# Altium schematic sheet Archim_TF_Top.SchDoc
size Tabloid
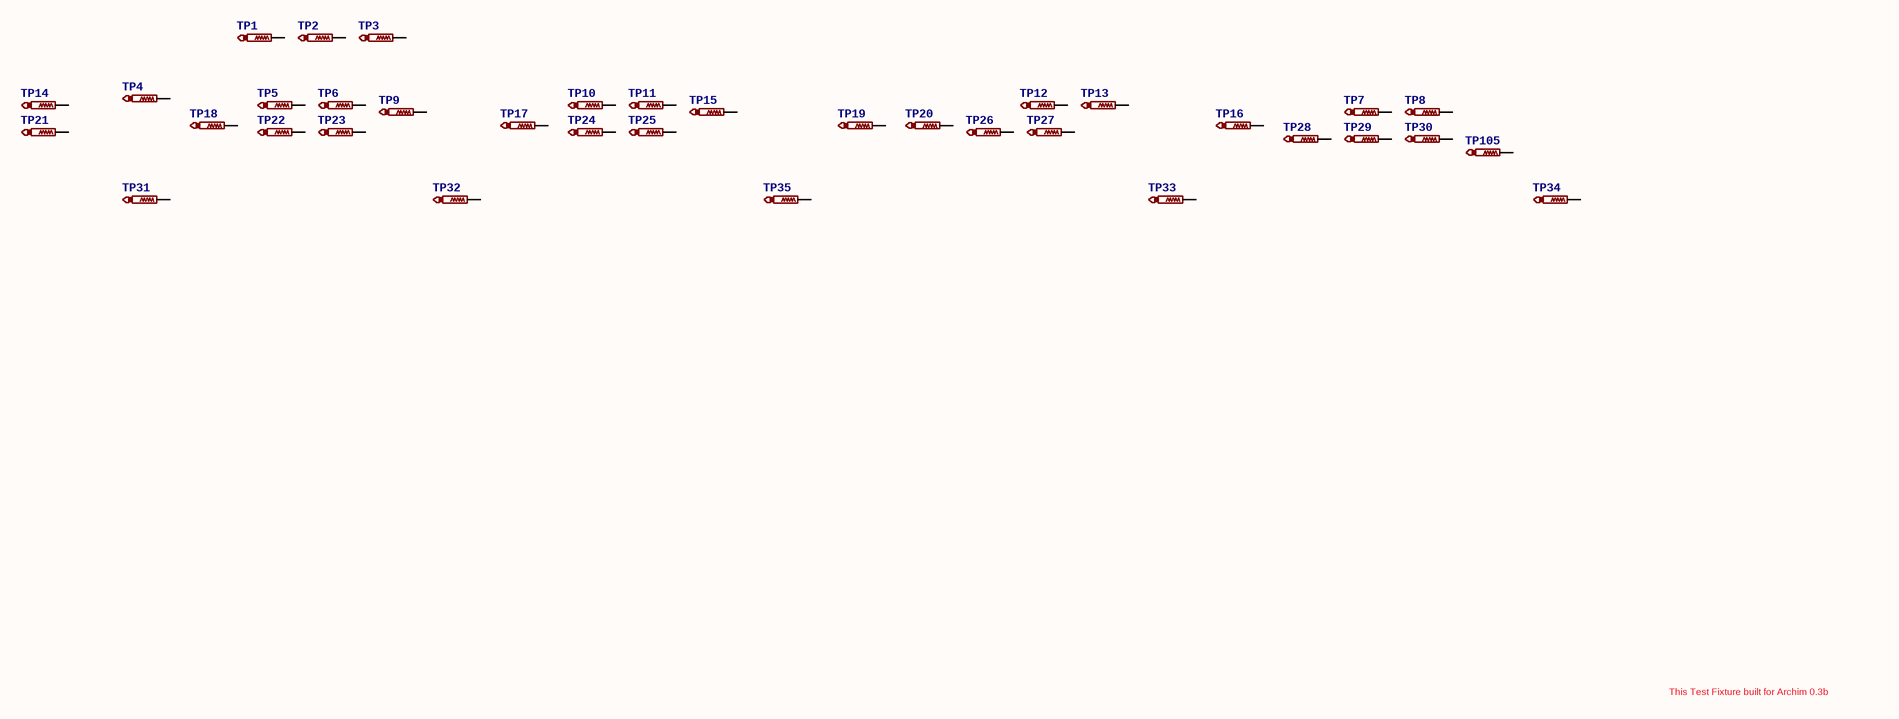
[diagram p0: Archim_TF_Top.SchDoc]

## Parts
TP1  P100-T  [POGO_38]  (value not drawn)
TP2  P100-T  [POGO_38]  (value not drawn)
TP3  P100-T  [POGO_38]  (value not drawn)
TP4  P100-T  [POGO_38]  (value not drawn)
TP5  P100-T  [POGO_38]  (value not drawn)
TP6  P100-T  [POGO_38]  (value not drawn)
TP7  P100-T  [POGO_38]  (value not drawn)
TP8  P100-T  [POGO_38]  (value not drawn)
TP9  P100-T  [POGO_38]  (value not drawn)
TP10  P100-T  [POGO_38]  (value not drawn)
TP11  P100-T  [POGO_38]  (value not drawn)
TP12  P100-T  [POGO_38]  (value not drawn)
TP13  P100-T  [POGO_38]  (value not drawn)
TP14  P100-T  [POGO_38]  (value not drawn)
TP15  P100-T  [POGO_38]  (value not drawn)
TP16  P100-T  [POGO_38]  (value not drawn)
TP17  P100-T  [POGO_38]  (value not drawn)
TP18  P100-T  [POGO_38]  (value not drawn)
TP19  P100-T  [POGO_38]  (value not drawn)
TP20  P100-T  [POGO_38]  (value not drawn)
TP21  P100-T  [POGO_38]  (value not drawn)
TP22  P100-T  [POGO_38]  (value not drawn)
TP23  P100-T  [POGO_38]  (value not drawn)
TP24  P100-T  [POGO_38]  (value not drawn)
TP25  P100-T  [POGO_38]  (value not drawn)
TP26  P100-T  [POGO_38]  (value not drawn)
TP27  P100-T  [POGO_38]  (value not drawn)
TP28  P100-T  [POGO_38]  (value not drawn)
TP29  P100-T  [POGO_38]  (value not drawn)
TP30  P100-T  [POGO_38]  (value not drawn)
TP31  P100-T  [POGO_38]  (value not drawn)
TP32  P100-T  [POGO_38]  (value not drawn)
TP33  P100-T  [POGO_38]  (value not drawn)
TP34  P100-T  [POGO_38]  (value not drawn)
TP35  P100-T  [POGO_38]  (value not drawn)
TP105  P100-T  [POGO_38]  (value not drawn)

## Nets

Not connected (* = marked no-connect by the designer): TP1 1(TP); TP2 1(TP); TP3 1(TP); TP4 1(TP); TP5 1(TP); TP6 1(TP); TP7 1(TP); TP8 1(TP); TP9 1(TP); TP10 1(TP); TP11 1(TP); TP12 1(TP); TP13 1(TP); TP14 1(TP); TP15 1(TP); TP16 1(TP); TP17 1(TP); TP18 1(TP); TP19 1(TP); TP20 1(TP); TP21 1(TP); TP22 1(TP); TP23 1(TP); TP24 1(TP); TP25 1(TP); TP26 1(TP); TP27 1(TP); TP28 1(TP); TP29 1(TP); TP30 1(TP); TP31 1(TP); TP32 1(TP); TP33 1(TP); TP34 1(TP); TP35 1(TP); TP105 1(TP)

## Notes on the sheet
- This Test Fixture built for Archim 0.3b

## Library data of the parts
TP1-TP35 TP105 = TestPoint: Test Point; LastRevisionNote: ImportComponents; Published: 23-Apr-2014; Publisher: UltiMachine; LastRevisionDate: 23-Apr-2014